# EAGLE schematic VCFA_v2 (EAGLE 9.4.2)

## Sheet 1 of 4: Balance Input Block
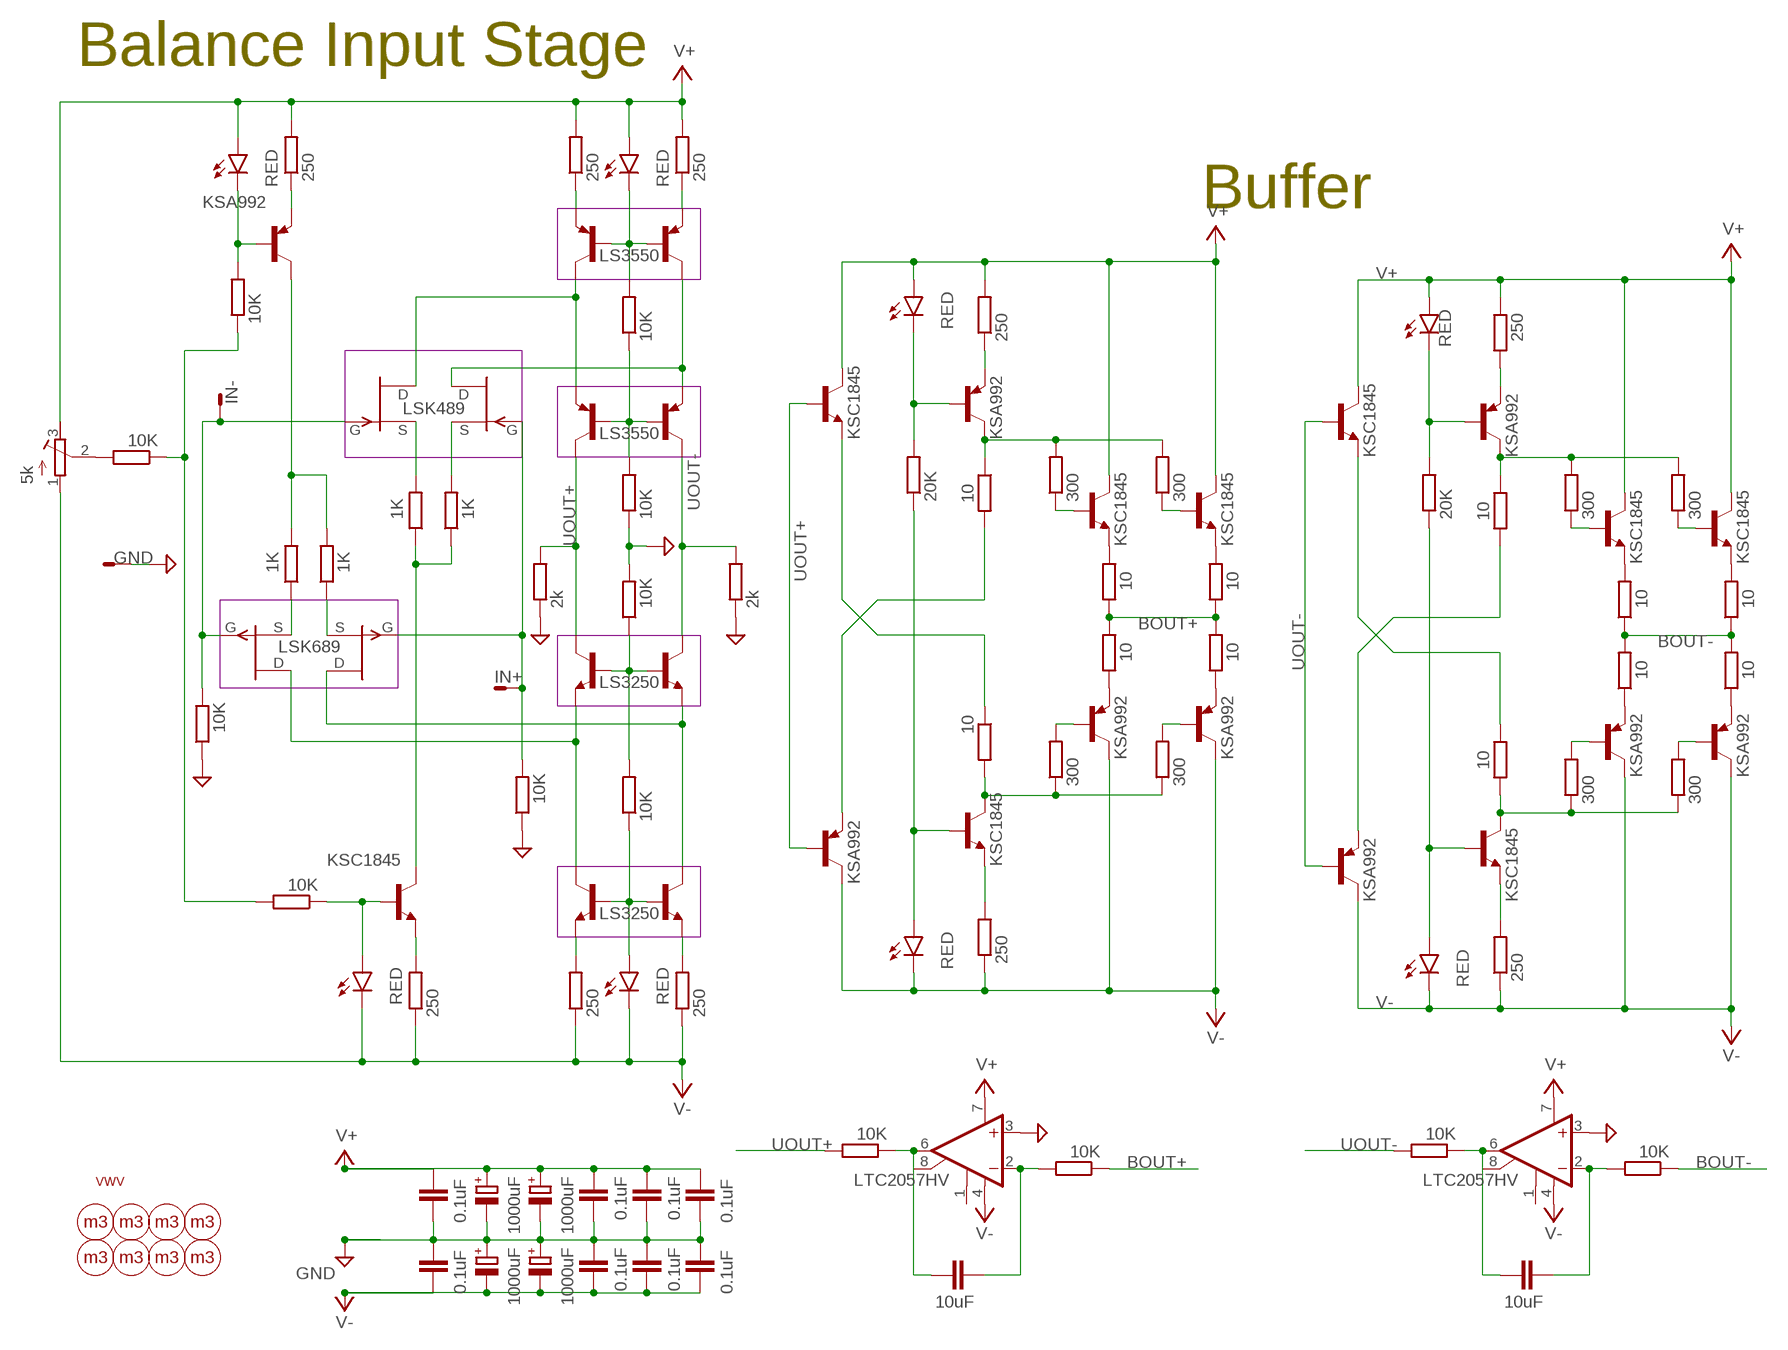
[diagram p0: schematic, sheet 1]

### Parts
C3  0.1uF  C-EUC0805  [C0805]
C4  0.1uF  C-EUC0805  [C0805]
C5  1000uF  CPOL-EUE7.5-18  [E7,5-18]
C6  1000uF  CPOL-EUE7.5-18  [E7,5-18]
C7  1000uF  CPOL-EUE7.5-18  [E7,5-18]
C8  1000uF  CPOL-EUE7.5-18  [E7,5-18]
C9  0.1uF  C-EU050-045X075  [C050-045X075]
C10  0.1uF  C-EU050-045X075  [C050-045X075]
C11  0.1uF  C-EU050-045X075  [C050-045X075]
C12  0.1uF  C-EU050-045X075  [C050-045X075]
C13  10uF  C-EUC1206  [C1206]
C14  0.1uF  C-EUC0805  [C0805]
C15  0.1uF  C-EUC0805  [C0805]
C16  10uF  C-EUC1206  [C1206]
H1  HOLE  [M3_HOLE]
H2  HOLE  [M3_HOLE]
H3  HOLE  [M3_HOLE]
H4  HOLE  [M3_HOLE]
H5  HOLE  [M3_HOLE]
H6  HOLE  [M3_HOLE]
H7  HOLE  [M3_HOLE]
H8  HOLE  [M3_HOLE]
IC1  LTC2057HV  LT1007CS8  [SOIC8]
IC2  LTC2057HV  LT1007CS8  [SOIC8]
LED1  RED  LEDVWV1206  [LED_SML1206]
LED2  RED  LEDVWV1206  [LED_SML1206]
LED3  RED  LEDVWV1206  [LED_SML1206]
LED4  RED  LEDVWV1206  [LED_SML1206]
LED5  RED  LEDVWV1206  [LED_SML1206]
LED6  RED  LEDVWV1206  [LED_SML1206]
LED7  RED  LEDVWV1206  [LED_SML1206]
LED8  RED  LEDVWV1206  [LED_SML1206]
Q1  LSK689  [SOT-23-6]
Q2  KSA992  BJT_PNPKSA992  [TRANSISTOR_TO92-ECB_P]
Q3  KSC1845  BJT_NPNKSC1845  [TRANSISTOR_TO92-ECB_N]
Q4  LSK489  LSK489SOP-6  [SOT-23-6]
Q5  LS3550  [SOT-23-6]
Q6  LS3250  [SOT-23-6]
Q7  LS3250  [SOT-23-6]
Q8  LS3550  [SOT-23-6]
Q9  KSC1845  BJT_NPNKSC1845  [TRANSISTOR_TO92-ECB_N]
Q10  KSA992  BJT_PNPKSA992  [TRANSISTOR_TO92-ECB_P]
Q11  KSA992  BJT_PNPKSA992  [TRANSISTOR_TO92-ECB_P]
Q12  KSC1845  BJT_NPNKSC1845  [TRANSISTOR_TO92-ECB_N]
Q13  KSC1845  BJT_NPNKSC1845  [TRANSISTOR_TO92-ECB_N]
Q14  KSA992  BJT_PNPKSA992  [TRANSISTOR_TO92-ECB_P]
Q15  KSC1845  BJT_NPNKSC1845  [TRANSISTOR_TO92-ECB_N]
Q16  KSA992  BJT_PNPKSA992  [TRANSISTOR_TO92-ECB_P]
Q17  KSC1845  BJT_NPNKSC1845  [TRANSISTOR_TO92-ECB_N]
Q18  KSA992  BJT_PNPKSA992  [TRANSISTOR_TO92-ECB_P]
Q19  KSA992  BJT_PNPKSA992  [TRANSISTOR_TO92-ECB_P]
Q20  KSC1845  BJT_NPNKSC1845  [TRANSISTOR_TO92-ECB_N]
Q21  KSC1845  BJT_NPNKSC1845  [TRANSISTOR_TO92-ECB_N]
Q22  KSA992  BJT_PNPKSA992  [TRANSISTOR_TO92-ECB_P]
Q23  KSC1845  BJT_NPNKSC1845  [TRANSISTOR_TO92-ECB_N]
Q24  KSA992  BJT_PNPKSA992  [TRANSISTOR_TO92-ECB_P]
R1  5k  R-TRIMM3296W  [RTRIM3296W]
R2  10K  R-EU_MELF0204W  [MINI_MELF-0204W]
R3  10K  R-EU_MELF0204W  [MINI_MELF-0204W]
R4  10K  R-EU_MELF0204W  [MINI_MELF-0204W]
R5  250  R-EU_MELF0204W  [MINI_MELF-0204W]
R6  1K  R-EU_MELF0204W  [MINI_MELF-0204W]
R7  250  R-EU_MELF0204W  [MINI_MELF-0204W]
R8  1K  R-EU_MELF0204W  [MINI_MELF-0204W]
R9  1K  R-EU_MELF0204W  [MINI_MELF-0204W]
R10  1K  R-EU_MELF0204W  [MINI_MELF-0204W]
R11  2k  R-EU_MELF0204W  [MINI_MELF-0204W]
R12  250  R-EU_MELF0204W  [MINI_MELF-0204W]
R13  250  R-EU_MELF0204W  [MINI_MELF-0204W]
R14  10K  R-EU_MELF0204W  [MINI_MELF-0204W]
R15  10K  R-EU_MELF0204W  [MINI_MELF-0204W]
R16  10K  R-EU_MELF0204W  [MINI_MELF-0204W]
R17  10K  R-EU_MELF0204W  [MINI_MELF-0204W]
R18  250  R-EU_MELF0204W  [MINI_MELF-0204W]
R19  250  R-EU_MELF0204W  [MINI_MELF-0204W]
R20  2k  R-EU_MELF0204W  [MINI_MELF-0204W]
R21  10K  R-EU_MELF0204W  [MINI_MELF-0204W]
R22  20K  R-EU_MELF0204W  [MINI_MELF-0204W]
R23  250  R-EU_MELF0204W  [MINI_MELF-0204W]
R24  10  R-EU_MELF0204W  [MINI_MELF-0204W]
R25  10  R-EU_MELF0204W  [MINI_MELF-0204W]
R26  250  R-EU_MELF0204W  [MINI_MELF-0204W]
R27  300  R-EU_MELF0204W  [MINI_MELF-0204W]
R28  300  R-EU_MELF0204W  [MINI_MELF-0204W]
R29  10K  R-EU_MELF0204W  [MINI_MELF-0204W]
R30  10  R-EU_MELF0204W  [MINI_MELF-0204W]
R31  10  R-EU_MELF0204W  [MINI_MELF-0204W]
R32  300  R-EU_MELF0204W  [MINI_MELF-0204W]
R33  300  R-EU_MELF0204W  [MINI_MELF-0204W]
R34  10  R-EU_MELF0204W  [MINI_MELF-0204W]
R35  10  R-EU_MELF0204W  [MINI_MELF-0204W]
R36  10K  R-EU_MELF0204W  [MINI_MELF-0204W]
R37  20K  R-EU_MELF0204W  [MINI_MELF-0204W]
R38  250  R-EU_MELF0204W  [MINI_MELF-0204W]
R39  10  R-EU_MELF0204W  [MINI_MELF-0204W]
R40  10  R-EU_MELF0204W  [MINI_MELF-0204W]
R41  250  R-EU_MELF0204W  [MINI_MELF-0204W]
R42  300  R-EU_MELF0204W  [MINI_MELF-0204W]
R43  300  R-EU_MELF0204W  [MINI_MELF-0204W]
R44  10K  R-EU_MELF0204W  [MINI_MELF-0204W]
R45  10  R-EU_MELF0204W  [MINI_MELF-0204W]
R46  10  R-EU_MELF0204W  [MINI_MELF-0204W]
R47  300  R-EU_MELF0204W  [MINI_MELF-0204W]
R48  300  R-EU_MELF0204W  [MINI_MELF-0204W]
R49  10  R-EU_MELF0204W  [MINI_MELF-0204W]
R50  10  R-EU_MELF0204W  [MINI_MELF-0204W]
R134  10K  R-EU_MELF0204W  [MINI_MELF-0204W]
R135  10K  R-EU_MELF0204W  [MINI_MELF-0204W]
S1  VWV  [VWV]
X1  KK-156-3  [KK-156-3]

### Nets
BOUT+: R29.1 R30.1 R31.2 R34.1 R35.2 ; also sheet 2
BOUT-: R44.1 R45.1 R46.2 R49.1 R50.2 ; also sheet 2
GND: C3.1 C4.2 C5.- C6.+ C7.- C8.+ C9.2 C10.1 C11.2 C12.1 C14.1 C15.2 IC1.3(+IN) IC2.3(+IN) R11.1 R15.1 R16.2 R20.1 R134.1 R135.1 X1.2 ; also sheet 2,3,4
IN+: Q1.4(G) Q4.4(G) R134.2 X1.3
IN-: Q1.1(G) Q4.1(G) R135.2 X1.1
N$2: Q8.2(E) R12.1
N$4: Q10.E R24.2
N$5: Q12.E R26.2
N$6: Q11.E R23.1
N$7: LED5.C Q11.B R22.2
N$8: LED6.A Q12.B R22.1
N$9: Q11.C R24.1 R27.2 R32.2
N$10: Q12.C R25.2 R28.1 R33.1
N$11: Q9.E R25.1
N$13: Q13.B R27.1
N$14: Q13.E R30.2
N$15: Q16.B R33.2
N$16: Q15.B R32.1
N$17: Q14.B R28.2
N$18: Q14.E R31.1
N$19: C13.2 IC1.2(-IN) R29.2
N$20: Q15.E R34.2
N$21: Q16.E R35.1
N$22: C13.1 IC1.6(OUT) R21.1
N$23: Q8.5(E) R18.1
N$24: R2.1 R3.1 R4.2
N$43: Q20.E R41.2
N$44: Q19.E R38.1
N$45: LED7.C Q19.B R37.2
N$46: LED8.A Q20.B R37.1
N$47: Q19.C R39.1 R42.2 R47.2
N$48: Q20.C R40.2 R43.1 R48.1
N$49: Q18.E R39.2
N$50: Q17.E R40.1
N$52: Q21.B R42.1
N$53: Q22.B R43.2
N$54: Q23.B R47.1
N$55: Q24.B R48.2
N$56: Q21.E R45.2
N$57: Q22.E R46.1
N$58: Q23.E R49.2
N$59: Q24.E R50.1
N$60: C16.2 IC2.2(-IN) R44.2
N$61: C16.1 IC2.6(OUT) R36.1
N$92: R1.2(S) R2.2
N$93: Q7.5(E) R13.2
N$94: Q7.2(E) R19.2
N$95: Q1.5(D) Q6.2(E) Q7.4(C)
N$96: Q1.2(D) Q6.5(E) Q7.6(C)
N$97: LED4.A Q7.1(B) Q7.3(B) R17.1
N$98: Q6.1(B) Q6.3(B) R16.1 R17.2
N$99: LED2.A Q3.B R4.1
N$101: Q5.1(B) Q5.3(B) R14.1 R15.2
N$102: Q4.2(D) Q5.5(E) Q8.4(C)
N$103: LED3.C Q8.1(B) Q8.3(B) R14.2
N$104: Q4.5(D) Q5.2(E) Q8.6(C)
N$108: LED1.C Q2.B R3.2
N$109: Q2.E R5.1
N$110: Q2.C R6.2 R8.2
N$111: Q1.6(S) R8.1
N$112: Q1.3(S) R6.1
N$115: Q4.3(S) R9.2
N$116: Q4.6(S) R10.2
N$117: Q3.C R9.1 R10.1
N$118: Q3.E R7.2
UOUT+: Q5.6(C) Q6.6(C) Q9.B Q10.B R11.2 R21.2
UOUT-: Q5.4(C) Q6.4(C) Q17.B Q18.B R20.2 R36.2
V+: C3.2 C5.+ C7.+ C9.1 C11.1 C14.2 IC1.7(V+) IC2.7(V+) LED1.A LED3.A LED5.A LED7.A Q9.C Q13.C Q15.C Q17.C Q21.C Q23.C R1.3(E) R5.2 R12.2 R18.2 R23.2 R38.2 ; also sheet 2,3
V-: C4.1 C6.- C8.- C10.2 C12.2 C15.1 IC1.4(V-) IC2.4(V-) LED2.C LED4.C LED6.C LED8.C Q10.C Q14.C Q16.C Q18.C Q22.C Q24.C R1.1(A) R7.1 R13.1 R19.1 R26.1 R41.1 ; also sheet 2,3
Unconnected: IC1.1(CMP1) IC1.8(CMP2) IC2.1(CMP1) IC2.8(CMP2)

### Notes on the sheet
- Balance Input Stage
- Buffer

## Sheet 2 of 4: CFA Block
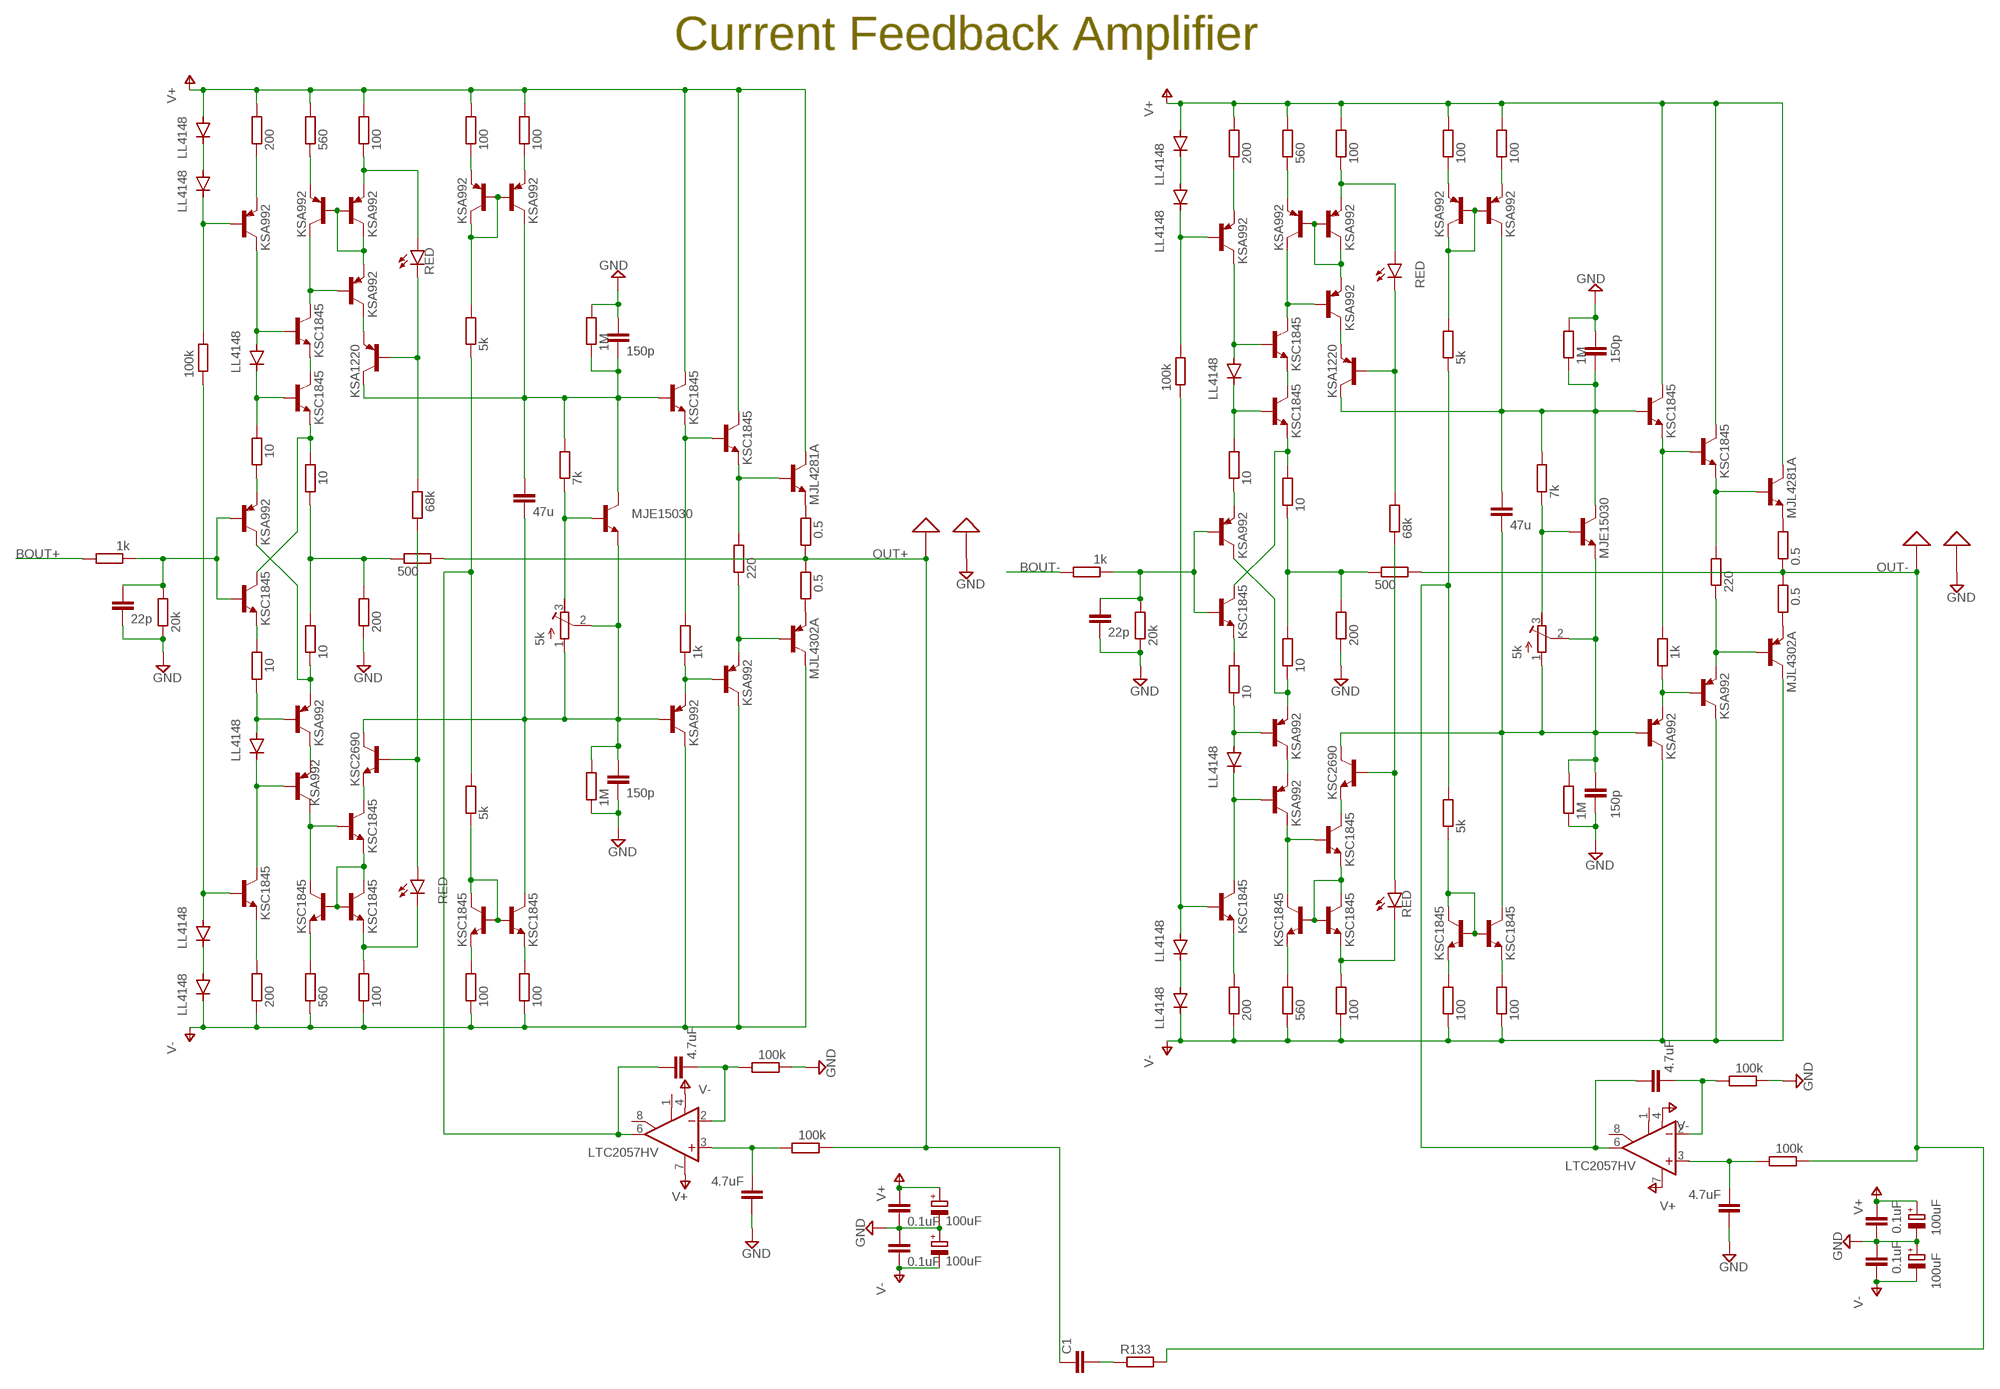
[diagram p1: schematic, sheet 2]

### Parts
C1  C-EUECWU-V  [ECHU-Y]
C17  22p  C-EUC0805  [C0805]
C18  47u  C-EUC1210  [C1210]
C19  150p  C-EUC0805  [C0805]
C20  150p  C-EUC0805  [C0805]
C21  4.7uF  C-EUC1210  [C1210]
C22  4.7uF  C-EUC1210  [C1210]
C23  0.1uF  C-EUC0603K  [C0603K]
C24  0.1uF  C-EUC0603K  [C0603K]
C25  100uF  CPOL-EUE3.5-8  [E3,5-8]
C26  100uF  CPOL-EUE3.5-8  [E3,5-8]
C27  22p  C-EUC0805  [C0805]
C28  47u  C-EUC1210  [C1210]
C29  150p  C-EUC0805  [C0805]
C30  150p  C-EUC0805  [C0805]
C31  4.7uF  C-EUC1210  [C1210]
C32  4.7uF  C-EUC1210  [C1210]
C33  0.1uF  C-EUC0603K  [C0603K]
C34  0.1uF  C-EUC0603K  [C0603K]
C35  100uF  CPOL-EUE3.5-8  [E3,5-8]
C36  100uF  CPOL-EUE3.5-8  [E3,5-8]
D1  LL4148  DIODE-SOD80C  [SOD80C]
D2  LL4148  DIODE-SOD80C  [SOD80C]
D3  LL4148  DIODE-SOD80C  [SOD80C]
D4  LL4148  DIODE-SOD80C  [SOD80C]
D5  LL4148  DIODE-SOD80C  [SOD80C]
D6  LL4148  DIODE-SOD80C  [SOD80C]
D7  LL4148  DIODE-SOD80C  [SOD80C]
D8  LL4148  DIODE-SOD80C  [SOD80C]
D9  LL4148  DIODE-SOD80C  [SOD80C]
D10  LL4148  DIODE-SOD80C  [SOD80C]
D11  LL4148  DIODE-SOD80C  [SOD80C]
D12  LL4148  DIODE-SOD80C  [SOD80C]
IC3  LTC2057HV  LT1037IS8  [SOIC8]
IC4  LTC2057HV  LT1037IS8  [SOIC8]
LED9  RED  LEDVWV1206  [LED_SML1206]
LED10  RED  LEDVWV1206  [LED_SML1206]
LED11  RED  LEDVWV1206  [LED_SML1206]
LED12  RED  LEDVWV1206  [LED_SML1206]
PAD1  PAD  [PAD-16]
PAD2  PAD  [PAD-16]
PAD3  PAD  [PAD-16]
PAD4  PAD  [PAD-16]
Q25  KSA992  BJT_PNPKSA992  [TRANSISTOR_TO92-ECB_P]
Q26  KSA992  BJT_PNPKSA992  [TRANSISTOR_TO92-ECB_P]
Q27  KSC1845  BJT_NPNKSC1845  [TRANSISTOR_TO92-ECB_N]
Q28  KSC1845  BJT_NPNKSC1845  [TRANSISTOR_TO92-ECB_N]
Q29  KSC1845  BJT_NPNKSC1845  [TRANSISTOR_TO92-ECB_N]
Q30  KSC1845  BJT_NPNKSC1845  [TRANSISTOR_TO92-ECB_N]
Q31  KSA992  BJT_PNPKSA992  [TRANSISTOR_TO92-ECB_P]
Q32  KSA992  BJT_PNPKSA992  [TRANSISTOR_TO92-ECB_P]
Q33  KSA992  BJT_PNPKSA992  [TRANSISTOR_TO92-ECB_P]
Q34  KSC1845  BJT_NPNKSC1845  [TRANSISTOR_TO92-ECB_N]
Q35  KSA992  BJT_PNPKSA992  [TRANSISTOR_TO92-ECB_P]
Q36  KSA992  BJT_PNPKSA992  [TRANSISTOR_TO92-ECB_P]
Q37  KSC1845  BJT_NPNKSC1845  [TRANSISTOR_TO92-ECB_N]
Q38  KSC1845  BJT_NPNKSC1845  [TRANSISTOR_TO92-ECB_N]
Q39  KSA1220  BJT_PNPKSA1220  [TRANSISTOR_TO126_P]
Q40  KSC2690  BJT_NPNKSC2690  [TRANSISTOR_TO126_N]
Q41  KSA992  BJT_PNPKSA992  [TRANSISTOR_TO92-ECB_P]
Q42  KSC1845  BJT_NPNKSC1845  [TRANSISTOR_TO92-ECB_N]
Q43  KSA992  BJT_PNPKSA992  [TRANSISTOR_TO92-ECB_P]
Q44  KSC1845  BJT_NPNKSC1845  [TRANSISTOR_TO92-ECB_N]
Q45  MJE15030  BJT_NPNMJE15030  [TRANSISTOR_TO220_BCE_N]
Q46  KSC1845  BJT_NPNKSC1845  [TRANSISTOR_TO92-ECB_N]
Q47  KSA992  BJT_PNPKSA992  [TRANSISTOR_TO92-ECB_P]
Q48  KSC1845  BJT_NPNKSC1845  [TRANSISTOR_TO92-ECB_N]
Q49  KSA992  BJT_PNPKSA992  [TRANSISTOR_TO92-ECB_P]
Q50  MJL4281A  BJT_NPNMJL4281  [TRANSISTOR_TO247_BCE_N]
Q51  MJL4302A  BJT_PNPMJL4302  [TRANSISTOR_TO247_BCE_P]
Q52  KSA992  BJT_PNPKSA992  [TRANSISTOR_TO92-ECB_P]
Q53  KSA992  BJT_PNPKSA992  [TRANSISTOR_TO92-ECB_P]
Q54  KSC1845  BJT_NPNKSC1845  [TRANSISTOR_TO92-ECB_N]
Q55  KSC1845  BJT_NPNKSC1845  [TRANSISTOR_TO92-ECB_N]
Q56  KSC1845  BJT_NPNKSC1845  [TRANSISTOR_TO92-ECB_N]
Q57  KSC1845  BJT_NPNKSC1845  [TRANSISTOR_TO92-ECB_N]
Q58  KSA992  BJT_PNPKSA992  [TRANSISTOR_TO92-ECB_P]
Q59  KSA992  BJT_PNPKSA992  [TRANSISTOR_TO92-ECB_P]
Q60  KSA992  BJT_PNPKSA992  [TRANSISTOR_TO92-ECB_P]
Q61  KSC1845  BJT_NPNKSC1845  [TRANSISTOR_TO92-ECB_N]
Q62  KSA992  BJT_PNPKSA992  [TRANSISTOR_TO92-ECB_P]
Q63  KSA992  BJT_PNPKSA992  [TRANSISTOR_TO92-ECB_P]
Q64  KSC1845  BJT_NPNKSC1845  [TRANSISTOR_TO92-ECB_N]
Q65  KSC1845  BJT_NPNKSC1845  [TRANSISTOR_TO92-ECB_N]
Q66  KSA1220  BJT_PNPKSA1220  [TRANSISTOR_TO126_P]
Q67  KSC2690  BJT_NPNKSC2690  [TRANSISTOR_TO126_N]
Q68  KSA992  BJT_PNPKSA992  [TRANSISTOR_TO92-ECB_P]
Q69  KSC1845  BJT_NPNKSC1845  [TRANSISTOR_TO92-ECB_N]
Q70  KSA992  BJT_PNPKSA992  [TRANSISTOR_TO92-ECB_P]
Q71  KSC1845  BJT_NPNKSC1845  [TRANSISTOR_TO92-ECB_N]
Q72  MJE15030  BJT_NPNMJE15030  [TRANSISTOR_TO220_BCE_N]
Q73  KSC1845  BJT_NPNKSC1845  [TRANSISTOR_TO92-ECB_N]
Q74  KSA992  BJT_PNPKSA992  [TRANSISTOR_TO92-ECB_P]
Q75  KSC1845  BJT_NPNKSC1845  [TRANSISTOR_TO92-ECB_N]
Q76  KSA992  BJT_PNPKSA992  [TRANSISTOR_TO92-ECB_P]
Q77  MJL4281A  BJT_NPNMJL4281  [TRANSISTOR_TO247_BCE_N]
Q78  MJL4302A  BJT_PNPMJL4302  [TRANSISTOR_TO247_BCE_P]
R51  1k  R-EU_MELF0204W  [MINI_MELF-0204W]
R52  20k  R-EU_MELF0204W  [MINI_MELF-0204W]
R53  100k  R-EU_MELF0204W  [MINI_MELF-0204W]
R54  200  R-EU_MELF0204W  [MINI_MELF-0204W]
R55  10  R-EU_MELF0204W  [MINI_MELF-0204W]
R56  10  R-EU_MELF0204W  [MINI_MELF-0204W]
R57  200  R-EU_MELF0204W  [MINI_MELF-0204W]
R58  560  R-EU_MELF0204W  [MINI_MELF-0204W]
R59  10  R-EU_MELF0204W  [MINI_MELF-0204W]
R60  10  R-EU_MELF0204W  [MINI_MELF-0204W]
R61  560  R-EU_MELF0204W  [MINI_MELF-0204W]
R62  100  R-EU_MELF0204W  [MINI_MELF-0204W]
R63  200  R-EU_MELF0204W  [MINI_MELF-0204W]
R64  100  R-EU_MELF0204W  [MINI_MELF-0204W]
R65  68k  R-EU_MELF0204W  [MINI_MELF-0204W]
R66  500  R-EU_MELF0204W  [MINI_MELF-0204W]
R67  100  R-EU_MELF0204W  [MINI_MELF-0204W]
R68  5k  R-EU_MELF0204W  [MINI_MELF-0204W]
R69  5k  R-EU_MELF0204W  [MINI_MELF-0204W]
R70  100  R-EU_MELF0204W  [MINI_MELF-0204W]
R71  100  R-EU_MELF0204W  [MINI_MELF-0204W]
R72  100  R-EU_MELF0204W  [MINI_MELF-0204W]
R73  7k  R-EU_MELF0204W  [MINI_MELF-0204W]
R74  5k  R-TRIMM3296W  [RTRIM3296W]
R75  1M  R-EU_MELF0204W  [MINI_MELF-0204W]
R76  1M  R-EU_MELF0204W  [MINI_MELF-0204W]
R77  1k  R-EU_MELF0204W  [MINI_MELF-0204W]
R78  220  R-EU_MELF0204W  [MINI_MELF-0204W]
R79  100k  R-EU_MELF0204W  [MINI_MELF-0204W]
R80  0.5  R-EU_R2512  [R2512]
R81  0.5  R-EU_R2512  [R2512]
R82  100k  R-EU_MELF0204W  [MINI_MELF-0204W]
R83  1k  R-EU_MELF0204W  [MINI_MELF-0204W]
R84  20k  R-EU_MELF0204W  [MINI_MELF-0204W]
R85  100k  R-EU_MELF0204W  [MINI_MELF-0204W]
R86  200  R-EU_MELF0204W  [MINI_MELF-0204W]
R87  10  R-EU_MELF0204W  [MINI_MELF-0204W]
R88  10  R-EU_MELF0204W  [MINI_MELF-0204W]
R89  200  R-EU_MELF0204W  [MINI_MELF-0204W]
R90  560  R-EU_MELF0204W  [MINI_MELF-0204W]
R91  10  R-EU_MELF0204W  [MINI_MELF-0204W]
R92  10  R-EU_MELF0204W  [MINI_MELF-0204W]
R93  560  R-EU_MELF0204W  [MINI_MELF-0204W]
R94  100  R-EU_MELF0204W  [MINI_MELF-0204W]
R95  200  R-EU_MELF0204W  [MINI_MELF-0204W]
R96  100  R-EU_MELF0204W  [MINI_MELF-0204W]
R97  68k  R-EU_MELF0204W  [MINI_MELF-0204W]
R98  500  R-EU_MELF0204W  [MINI_MELF-0204W]
R99  100  R-EU_MELF0204W  [MINI_MELF-0204W]
R100  5k  R-EU_MELF0204W  [MINI_MELF-0204W]
R101  5k  R-EU_MELF0204W  [MINI_MELF-0204W]
R102  100  R-EU_MELF0204W  [MINI_MELF-0204W]
R103  100  R-EU_MELF0204W  [MINI_MELF-0204W]
R104  100  R-EU_MELF0204W  [MINI_MELF-0204W]
R105  7k  R-EU_MELF0204W  [MINI_MELF-0204W]
R106  5k  R-TRIMM3296W  [RTRIM3296W]
R107  1M  R-EU_MELF0204W  [MINI_MELF-0204W]
R108  1M  R-EU_MELF0204W  [MINI_MELF-0204W]
R109  1k  R-EU_MELF0204W  [MINI_MELF-0204W]
R110  220  R-EU_MELF0204W  [MINI_MELF-0204W]
R111  100k  R-EU_MELF0204W  [MINI_MELF-0204W]
R112  0.5  R-EU_R2512  [R2512]
R113  0.5  R-EU_R2512  [R2512]
R114  100k  R-EU_MELF0204W  [MINI_MELF-0204W]
R133  R-EU_R2512  [R2512]

### Nets
BOUT+: R51.2 ; also sheet 1
BOUT-: R83.2 ; also sheet 1
GND: C17.2 C19.1 C20.2 C22.1 C23.2 C24.1 C25.- C26.+ C27.2 C29.1 C30.2 C32.1 C33.2 C34.1 C35.- C36.+ PAD3.P$1 PAD4.P$1 R52.1 R63.1 R75.2 R76.1 R79.1 R84.1 R95.1 R107.2 R108.1 R111.1 ; also sheet 1,3,4
N$3: Q25.E R54.1
N$12: D5.A Q25.C Q29.B
N$25: D1.C D2.A
N$26: D2.C Q25.B R53.2
N$27: D5.C Q30.B R55.2
N$28: Q29.E Q30.C
N$29: Q27.C Q30.E R59.2
N$30: R59.1 R60.2 R63.2 R66.1
N$31: Q26.C Q31.E R60.1
N$32: D6.A Q31.B R56.1
N$33: D6.C Q28.C Q32.B
N$34: Q28.E R57.2
N$35: D3.C D4.A
N$36: Q31.C Q32.E
N$37: Q26.E R55.1
N$38: Q27.E R56.2
N$39: C17.1 Q26.B Q27.B R51.1 R52.2
N$40: Q29.C Q33.C Q36.B
N$41: Q33.B Q35.B Q35.C Q36.E
N$42: Q33.E R58.1
N$51: LED9.A Q35.E R62.1
N$62: Q36.C Q39.E
N$63: LED9.C Q39.B R65.2
N$64: Q34.B Q37.E Q38.B Q38.C
N$65: LED10.C Q38.E R64.2
N$66: Q34.E R61.2
N$67: Q32.C Q34.C Q37.B
N$68: Q37.C Q40.E
N$69: LED10.A Q40.B R65.1
N$70: C18.1 C19.2 Q39.C Q43.C Q45.C Q46.B R73.2 R75.1
N$71: Q41.B Q41.C Q43.B R68.2
N$72: Q42.B Q42.C Q44.B R69.1
N$73: Q41.E R67.1
N$74: Q43.E R71.1
N$76: Q42.E R70.2
N$77: Q44.E R72.2
N$78: Q46.E Q48.B R77.2
N$79: Q47.E Q49.B R77.1
N$80: C18.2 C20.1 Q40.C Q44.C Q45.E Q47.B R74.1(A) R74.2(S) R76.2
N$81: Q48.E Q50.B R78.2
N$82: Q49.E Q51.B R78.1
N$83: Q50.E R80.2
N$84: Q51.E R81.1
N$85: C21.2 IC3.2(-IN) R79.2
N$86: C22.2 IC3.3(+IN) R82.2
N$87: D3.A Q28.B R53.1
N$88: Q45.B R73.1 R74.3(E)
N$89: C21.1 IC3.6(OUT) R68.1 R69.2
N$140: C1.2 R133.1
N$159: Q52.E R86.1
N$160: D11.A Q52.C Q56.B
N$161: D7.C D8.A
N$162: D8.C Q52.B R85.2
N$163: D11.C Q57.B R87.2
N$164: Q56.E Q57.C
N$165: Q54.C Q57.E R91.2
N$166: R91.1 R92.2 R95.2 R98.1
N$167: Q53.C Q58.E R92.1
N$168: D12.A Q58.B R88.1
N$169: D12.C Q55.C Q59.B
N$170: Q55.E R89.2
N$171: D9.C D10.A
N$172: Q58.C Q59.E
N$173: Q53.E R87.1
N$174: Q54.E R88.2
N$175: C27.1 Q53.B Q54.B R83.1 R84.2
N$176: Q56.C Q60.C Q63.B
N$177: Q60.B Q62.B Q62.C Q63.E
N$178: Q60.E R90.1
N$179: LED11.A Q62.E R94.1
N$180: Q63.C Q66.E
N$181: LED11.C Q66.B R97.2
N$182: Q61.B Q64.E Q65.B Q65.C
N$231: LED12.C Q65.E R96.2
N$232: Q61.E R93.2
N$233: Q59.C Q61.C Q64.B
N$234: Q64.C Q67.E
N$235: LED12.A Q67.B R97.1
N$236: C28.1 C29.2 Q66.C Q70.C Q72.C Q73.B R105.2 R107.1
N$237: Q68.B Q68.C Q70.B R100.2
N$238: Q69.B Q69.C Q71.B R101.1
N$239: Q68.E R99.1
N$240: Q70.E R103.1
N$242: Q69.E R102.2
N$243: Q71.E R104.2
N$244: Q73.E Q75.B R109.2
N$245: Q74.E Q76.B R109.1
N$246: C28.2 C30.1 Q67.C Q71.C Q72.E Q74.B R106.1(A) R106.2(S) R108.2
N$247: Q75.E Q77.B R110.2
N$248: Q76.E Q78.B R110.1
N$249: Q77.E R112.2
N$250: Q78.E R113.1
N$251: C31.2 IC4.2(-IN) R111.2
N$252: C32.2 IC4.3(+IN) R114.2
N$253: D9.A Q55.B R85.1
N$254: Q72.B R105.1 R106.3(E)
N$255: C31.1 IC4.6(OUT) R100.1 R101.2
OUT+: C1.1 PAD1.P$1 R66.2 R80.1 R81.2 R82.1
OUT-: PAD2.P$1 R98.2 R112.1 R113.2 R114.1 R133.2
V+: C23.1 C25.+ C33.1 C35.+ D1.A D7.A IC3.7(V+) IC4.7(V+) Q46.C Q48.C Q50.C Q73.C Q75.C Q77.C R54.2 R58.2 R62.2 R67.2 R71.2 R86.2 R90.2 R94.2 R99.2 R103.2 ; also sheet 1,3
V-: C24.2 C26.- C34.2 C36.- D4.C D10.C IC3.4(V-) IC4.4(V-) Q47.C Q49.C Q51.C Q74.C Q76.C Q78.C R57.1 R61.1 R64.1 R70.1 R72.1 R89.1 R93.1 R96.1 R102.1 R104.1 ; also sheet 1,3
Unconnected: IC3.1(CMP1) IC3.8(CMP2) IC4.1(CMP1) IC4.8(CMP2)

### Notes on the sheet
- Current Feedback Amplifier

## Sheet 3 of 4: Power Supply
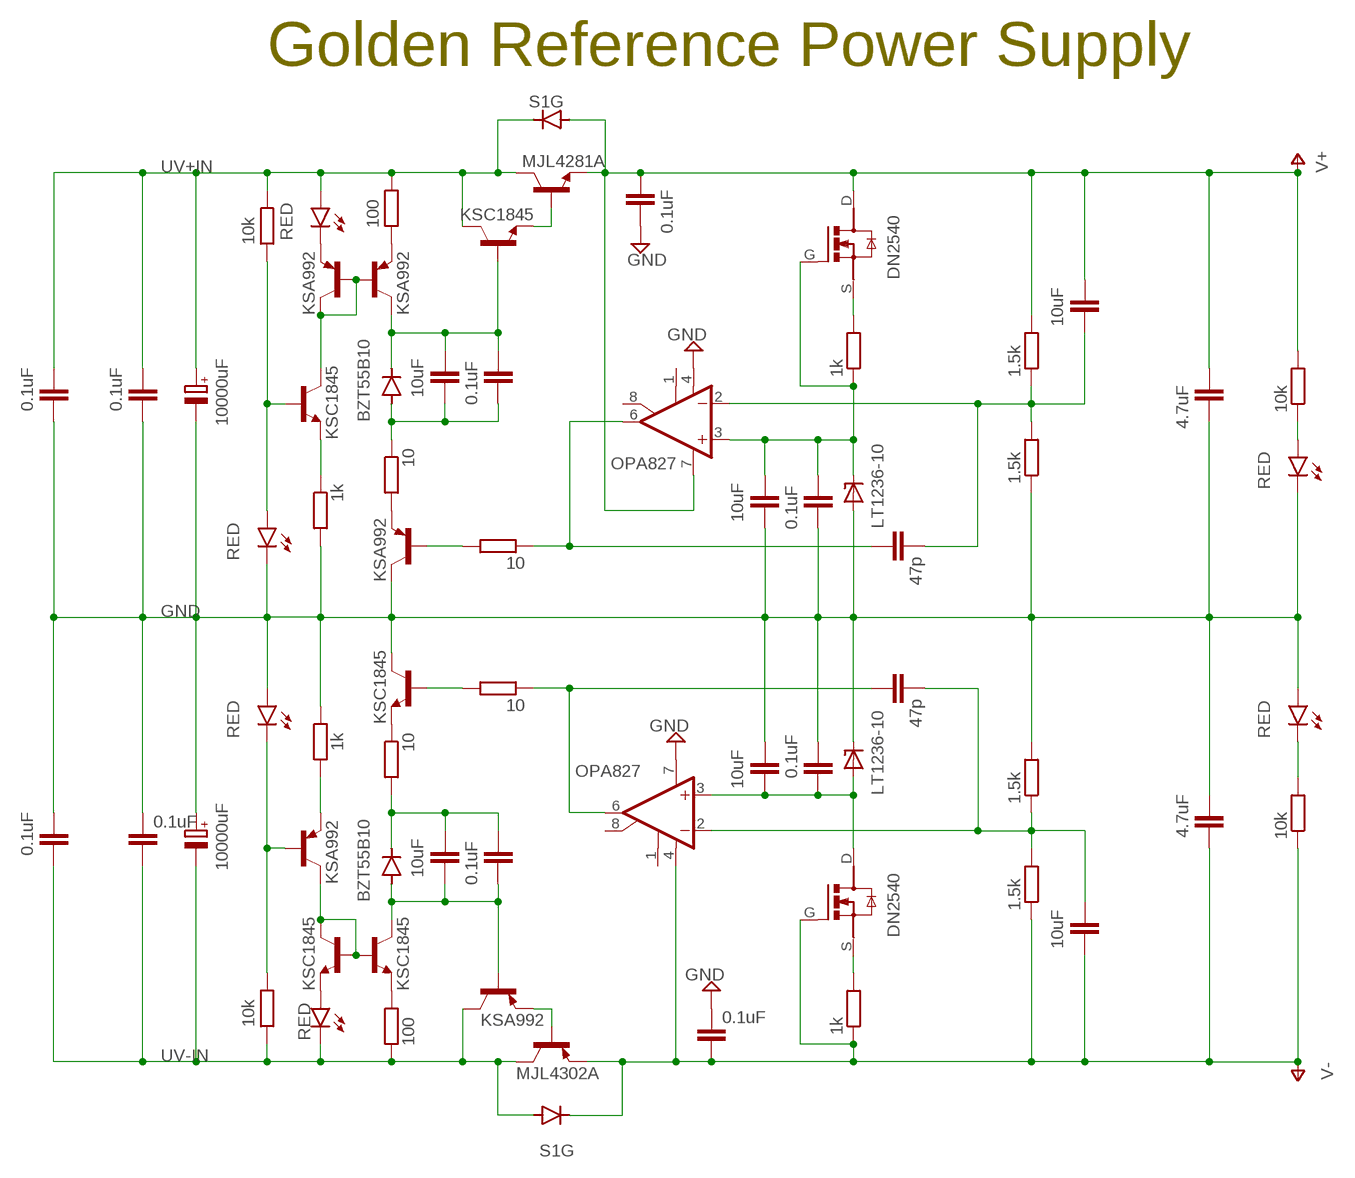
[diagram p2: schematic, sheet 3]

### Parts
C37  10000uF  CPOL-EU  [EB35D-8.5]
C38  10000uF  CPOL-EU  [EB35D-8.5]
C39  0.1uF  C-EU050-045X075  [C050-045X075]
C40  10uF  C-EUC1206  [C1206]
C41  10uF  C-EUC1206  [C1206]
C42  0.1uF  C-EU050-045X075  [C050-045X075]
C43  0.1uF  C-EUC0805  [C0805]
C44  0.1uF  C-EUC0805  [C0805]
C45  0.1uF  C-EUC0805  [C0805]
C46  0.1uF  C-EUC0805  [C0805]
C47  10uF  C-EUC1206  [C1206]
C48  10uF  C-EUC1206  [C1206]
C49  0.1uF  C-EUC0805  [C0805]
C50  0.1uF  C-EUC0805  [C0805]
C51  47p  C-EUC0805  [C0805]
C52  47p  C-EUC0805  [C0805]
C53  10uF  C-EUC1206  [C1206]
C54  10uF  C-EUC1206  [C1206]
C55  4.7uF  C-EU050-075X075  [C050-075X075]
C56  4.7uF  C-EU050-075X075  [C050-075X075]
C58  0.1uF  C-EU050-045X075  [C050-045X075]
C60  0.1uF  C-EU050-045X075  [C050-045X075]
D13  BZT55B10  DIODE-SOD80C  [SOD80C]
D14  BZT55B10  DIODE-SOD80C  [SOD80C]
D15  S1G  DIODE-DO214AA  [DO214AA]
D16  S1G  DIODE-DO214AA  [DO214AA]
D17  LT1236-10  LINEAR-TECHNOLOGY_LT1021-VSO-8  [SO8]
D18  LT1236-10  LINEAR-TECHNOLOGY_LT1021-VSO-8  [SO8]
IC5  OPA827  LT1037CS8  [SOIC8]
IC6  OPA827  LT1037CS8  [SOIC8]
LED13  RED  LEDVWV1206  [LED_SML1206]
LED14  RED  LEDVWV1206  [LED_SML1206]
LED15  RED  LEDVWV1206  [LED_SML1206]
LED16  RED  LEDVWV1206  [LED_SML1206]
LED17  RED  LEDVWV1206  [LED_SML1206]
LED18  RED  LEDVWV1206  [LED_SML1206]
Q79  KSC1845  BJT_NPNKSC1845  [TRANSISTOR_TO92-ECB_N]
Q80  KSA992  BJT_PNPKSA992  [TRANSISTOR_TO92-ECB_P]
Q81  KSA992  BJT_PNPKSA992  [TRANSISTOR_TO92-ECB_P]
Q82  KSC1845  BJT_NPNKSC1845  [TRANSISTOR_TO92-ECB_N]
Q83  KSA992  BJT_PNPKSA992  [TRANSISTOR_TO92-ECB_P]
Q84  KSC1845  BJT_NPNKSC1845  [TRANSISTOR_TO92-ECB_N]
Q85  KSA992  BJT_PNPKSA992  [TRANSISTOR_TO92-ECB_P]
Q86  KSC1845  BJT_NPNKSC1845  [TRANSISTOR_TO92-ECB_N]
Q87  KSC1845  BJT_NPNKSC1845  [TRANSISTOR_TO92-ECB_N]
Q88  KSA992  BJT_PNPKSA992  [TRANSISTOR_TO92-ECB_P]
Q89  MJL4281A  BJT_NPNMJL4281  [TRANSISTOR_TO247_BCE_N]
Q90  MJL4302A  BJT_PNPMJL4302  [TRANSISTOR_TO247_BCE_P]
Q91  DN2540  [TRANSISTOR_TO92-SGD_N]
Q92  DN2540  [TRANSISTOR_TO92-SGD_N]
R115  10k  R-EU_MELF0204W  [MINI_MELF-0204W]
R116  10k  R-EU_MELF0204W  [MINI_MELF-0204W]
R117  1k  R-EU_MELF0204W  [MINI_MELF-0204W]
R118  1k  R-EU_MELF0204W  [MINI_MELF-0204W]
R119  100  R-EU_MELF0204W  [MINI_MELF-0204W]
R120  10  R-EU_MELF0204W  [MINI_MELF-0204W]
R121  10  R-EU_MELF0204W  [MINI_MELF-0204W]
R122  100  R-EU_MELF0204W  [MINI_MELF-0204W]
R123  10  R-EU_MELF0204W  [MINI_MELF-0204W]
R124  10  R-EU_MELF0204W  [MINI_MELF-0204W]
R125  1k  R-EU_MELF0204W  [MINI_MELF-0204W]
R126  1k  R-EU_MELF0204W  [MINI_MELF-0204W]
R127  1.5k  R-EU_MELF0204W  [MINI_MELF-0204W]
R128  1.5k  R-EU_MELF0204W  [MINI_MELF-0204W]
R129  1.5k  R-EU_MELF0204W  [MINI_MELF-0204W]
R130  1.5k  R-EU_MELF0204W  [MINI_MELF-0204W]
R131  10k  R-EU_MELF0204W  [MINI_MELF-0204W]
R132  10k  R-EU_MELF0204W  [MINI_MELF-0204W]

### Nets
GND: C37.- C38.+ C39.2 C42.1 C45.1 C46.2 C47.2 C48.1 C49.2 C50.1 C55.1 C56.2 C58.1 C60.2 D17.4(GND) D18.6(OUT) IC5.7(V+) IC6.4(V-) LED13.C LED14.A LED17.C LED18.A Q85.C Q86.C R117.2 R118.1 R128.1 R129.2 ; also sheet 1,2,4
N$1: Q79.C Q81.B Q81.C Q83.B
N$75: LED15.C Q81.E
N$90: Q83.E R119.2
N$100: C40.1 C43.1 D13.C Q83.C Q87.B
N$105: C40.2 C43.2 D13.A R120.1
N$106: Q85.E R120.2
N$107: Q79.E R117.1
N$113: LED13.A Q79.B R115.2
N$114: Q80.E R118.2
N$119: LED14.C Q80.B R116.1
N$120: Q86.E R121.1
N$121: C41.1 C44.1 D14.C R121.2
N$122: C41.2 C44.2 D14.A Q84.C Q88.B
N$123: Q80.C Q82.B Q82.C Q84.B
N$124: Q84.E R122.1
N$125: LED16.A Q82.E
N$126: Q88.E Q90.B
N$127: Q87.E Q89.B
N$128: C51.1 IC6.6(OUT) R123.1
N$129: C52.1 IC5.6(OUT) R124.1
N$130: Q86.B R124.2
N$131: Q85.B R123.2
N$132: C51.2 C53.2 IC6.2(-IN) R127.1 R128.2
N$133: C47.1 C49.1 D17.6(OUT) IC6.3(+IN) Q91.G R125.1
N$134: Q91.S R125.2
N$135: C48.2 C50.2 D18.4(GND) IC5.3(+IN) Q92.D
N$136: Q92.S R126.2
N$137: C52.2 C54.1 IC5.2(-IN) R129.1 R130.2
N$138: LED18.C R132.2
N$139: LED17.A R131.1
UV+IN: C37.+ C42.2 C58.2 D15.C LED15.A Q87.C Q89.C R115.1 R119.1 ; also sheet 4
UV-IN: C38.- C39.1 C60.1 D16.A LED16.C Q88.C Q90.C R116.2 R122.2 ; also sheet 4
V+: C45.2 C53.1 C55.2 D15.A IC6.7(V+) Q89.E Q91.D R127.2 R131.2 ; also sheet 1,2
V-: C46.1 C54.2 C56.1 D16.C IC5.4(V-) Q90.E Q92.G R126.1 R130.1 R132.1 ; also sheet 1,2
Unconnected: IC5.1(CMP1) IC5.8(CMP2) IC6.1(CMP1) IC6.8(CMP2)

### Notes on the sheet
- Golden Reference Power Supply

## Sheet 4 of 4: 4.Sync Refi
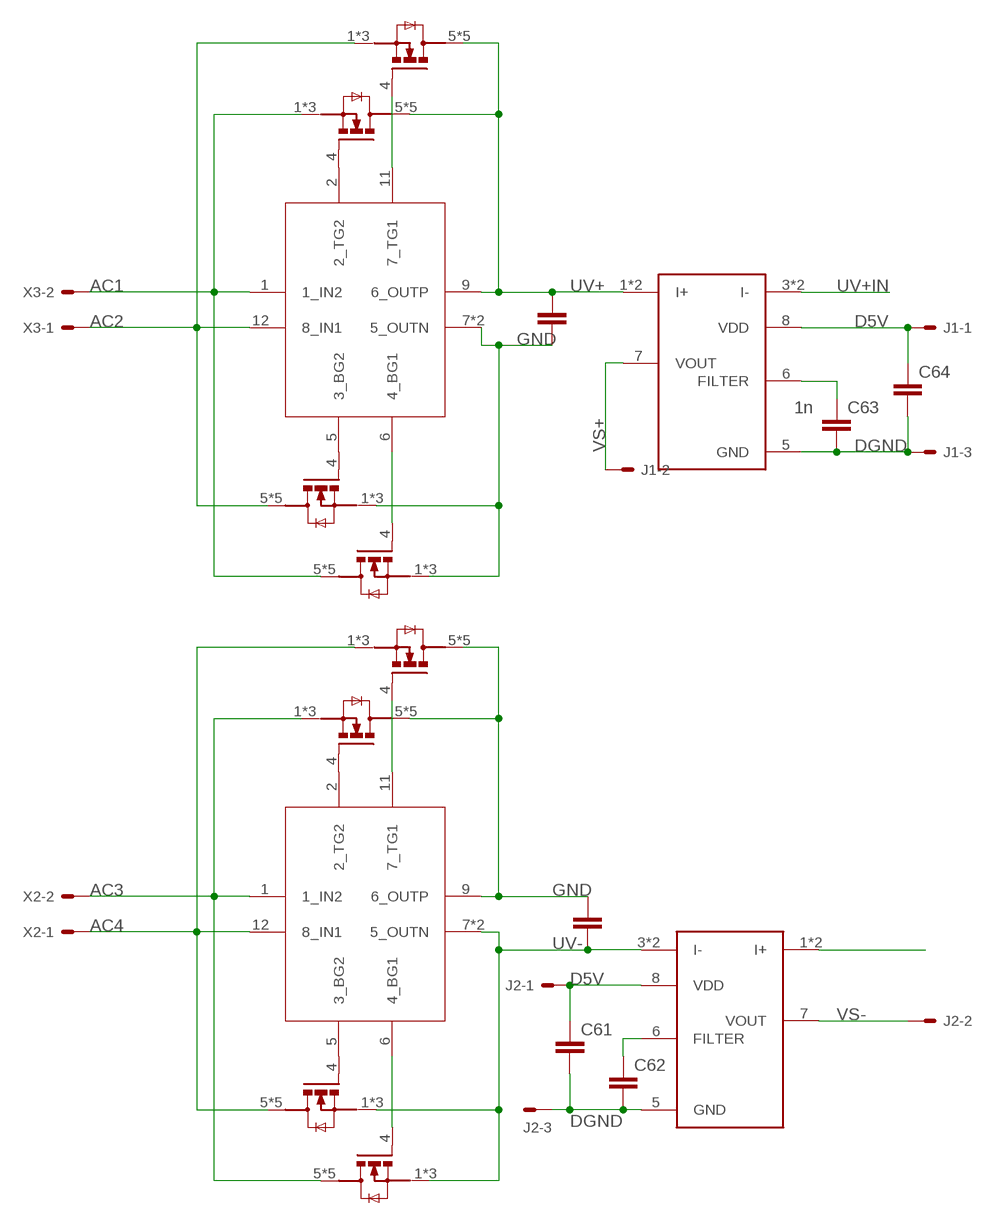
[diagram p3: schematic, sheet 4]

### Parts
C57  47uF  C-EUC1206  [C1206]
C59  47uF  C-EUC1206  [C1206]
C61  C-EUC0805  [C0805]
C62  C-EUC0805  [C0805]
C63  1n  C-EUC0805  [C0805]
C64  C-EUC0805  [C0805]
J1  22-27-2031-03  [6410-03]
J2  22-27-2031-03  [6410-03]
Q97  MOS_SMDTDSON-8  [PG-TDSON-8]
Q98  MOS_SMDTDSON-8  [PG-TDSON-8]
Q99  MOS_SMDTDSON-8  [PG-TDSON-8]
Q100  MOS_SMDTDSON-8  [PG-TDSON-8]
Q105  MOS_SMDTDSON-8  [PG-TDSON-8]
Q106  MOS_SMDTDSON-8  [PG-TDSON-8]
Q107  MOS_SMDTDSON-8  [PG-TDSON-8]
Q108  MOS_SMDTDSON-8  [PG-TDSON-8]
U$1  ACHS-712X  [SO8]
U$2  LT4320MSOP  [LT4320_MSOP]
U$3  ACHS-712X  [SO8]
U$4  LT4320MSOP  [LT4320_MSOP]
X2  KK-156-2  [KK-156-2]
X3  KK-156-2  [KK-156-2]

### Nets
AC1: Q97.1(S) Q97.2(S) Q97.3(S) Q100.5(D) Q100.6(D) Q100.7(D) Q100.8(D) Q100.TH(D) U$2.1(1_IN2) X3.2
AC2: Q98.1(S) Q98.2(S) Q98.3(S) Q99.5(D) Q99.6(D) Q99.7(D) Q99.8(D) Q99.TH(D) U$2.12(8_IN1) X3.1
AC3: Q105.1(S) Q105.2(S) Q105.3(S) Q108.5(D) Q108.6(D) Q108.7(D) Q108.8(D) Q108.TH(D) U$4.1(1_IN2) X2.2
AC4: Q106.1(S) Q106.2(S) Q106.3(S) Q107.5(D) Q107.6(D) Q107.7(D) Q107.8(D) Q107.TH(D) U$4.12(8_IN1) X2.1
D5V: C61.1 C64.1 J1.1 J2.1 U$1.8(VDD) U$3.8(VDD)
DGND: C61.2 C62.2 C63.2 C64.2 J1.3 J2.3 U$1.5(GND) U$3.5(GND)
GND: C57.2 C59.1 Q99.1(S) Q99.2(S) Q99.3(S) Q100.1(S) Q100.2(S) Q100.3(S) Q105.5(D) Q105.6(D) Q105.7(D) Q105.8(D) Q105.TH(D) Q106.5(D) Q106.6(D) Q106.7(D) Q106.8(D) Q106.TH(D) U$2.7(5_OUTN) U$2.EXP(5_OUTN) U$4.9(6_OUTP) ; also sheet 1,2,3
N$91: C62.1 U$3.6(FILTER)
N$143: C63.1 U$1.6(FILTER)
N$157: Q98.4(G) U$2.11(7_TG1)
N$184: Q100.4(G) U$2.6(4_BG1)
N$188: Q97.4(G) U$2.2(2_TG2)
N$189: Q99.4(G) U$2.5(3_BG2)
N$201: Q106.4(G) U$4.11(7_TG1)
N$204: Q108.4(G) U$4.6(4_BG1)
N$208: Q105.4(G) U$4.2(2_TG2)
N$209: Q107.4(G) U$4.5(3_BG2)
UV+: C57.1 Q97.5(D) Q97.6(D) Q97.7(D) Q97.8(D) Q97.TH(D) Q98.5(D) Q98.6(D) Q98.7(D) Q98.8(D) Q98.TH(D) U$1.1(I+) U$1.2(I+) U$2.9(6_OUTP)
UV+IN: U$1.3(I-) U$1.4(I-) ; also sheet 3
UV-: C59.2 Q107.1(S) Q107.2(S) Q107.3(S) Q108.1(S) Q108.2(S) Q108.3(S) U$3.3(I-) U$3.4(I-) U$4.7(5_OUTN) U$4.EXP(5_OUTN)
UV-IN: U$3.1(I+) U$3.2(I+) ; also sheet 3
VS+: J1.2 U$1.7(VOUT)
VS-: J2.2 U$3.7(VOUT)

## Library data of the parts
C1 C3 C4 C9-C16 C23 C24 C33 C34 C39-C64 = Vwvwbg:C-EU: CAPACITOR, European symbol
C5-C8 C25 C26 C35-C38 = Vwvwbg:CPOL-EU: POLARIZED CAPACITOR, European symbol
C17-C22 C27-C32 = Vwvwbg:C-EU: CAPACITOR, European symbol; SPICEPREFIX: C
D1-D12 = Vwvwbg:DIODE-: DIODE; SPICEPREFIX: D
D13-D16 = Vwvwbg:DIODE-: DIODE
D17 D18 = Vwvwbg:LINEAR-TECHNOLOGY_LT1021-V
H1-H8 = Vwvwbg:HOLE
IC1-IC6 = Vwvwbg:LT10*: Low Noise, High Speed, Precision Operational Amplifiers Source: http://www.linear.com/pc/downloadDocument.do?navId=H0,C1,C1154,C1009,C1026,P1212,D2204
J1 J2 = con-molex:22-?-03: CONNECTOR wire to board 2.54 mm (.1 inch) pitch header; MF: MOLEX; OC_FARNELL: unknown; OC_NEWARK: unknown
LED1 LED3-LED8 LED13-LED18 = Vwvwbg:LED: LED OSRAM: - CHIPLED LG R971, LG N971, LY N971, LG Q971, LY Q971, LO R971, LY R971 LH N974, LH R974 LS Q976, LO Q976, LY Q976 LO Q996 - Hyper CHIPLED LW Q18S LB Q993, LB Q99A, LB R99A - SideLED LS A670, LO A670, LY A670, LG A670, LP A670 LB A673, LV A673, LT A673, LW A673 LH A674 LY A675 LS A676, LA A676, LO A676, LY A676, LW A676 LS A679, LY A679, LG A679 - Hyper Micro SIDELED® LS Y876, LA Y876, LO Y876, LY Y876 LT Y87S - SmartLED LW L88C, LW L88S LB L89C, LB L89S, LG L890 LS L89K, LO L89K, LY L89K LS L896, LA L896, LO L896, LY L896 - TOPLED LS T670, LO T670, LY T670, LG T670, LP T670 LSG T670, LSP T670, LSY T670, LOP T670, LYG T670 LG T671, LOG T671, LSG T671 LB T673, LV T673, LT T673, LW T673 LH T674 LS T676, LA T676, LO T676, LY T676, LB T676, LH T676, LSB T676, LW T676 LB T67C, LV T67C, LT T67C, LS T67K, LO T67K, LY T67K, LW E67C LS E67B, LA E67B, LO E67B, LY E67B, LB E67C, LV E67C, LT E67C LW T67C LS T679, LY T679, LG T679 LS T770, LO T770, LY T770, LG T770, LP T770 LB T773, LV T773, LT T773, LW T773 LH T774 LS E675, LA E675, LY E675, LS T675 LS T776, LA T776, LO T776, LY T776, LB T776 LHGB T686 LT T68C, LB T68C - Hyper Mini TOPLED® LB M676 - Mini TOPLED Santana® LG M470 LS M47K, LO M47K, LY M47K Source: http://www.osram.convergy.de LUXEON: - LUMILED® LXK2-PW12-R00, LXK2-PW12-S00, LXK2-PW14-U00, LXK2-PW14-V00 LXK2-PM12-R00, LXK2-PM12-S00, LXK2-PM14-U00 LXK2-PE12-Q00, LXK2-PE12-R00, LXK2-PE12-S00, LXK2-PE14-T00, LXK2-PE14-U00 LXK2-PB12-K00, LXK2-PB12-L00, LXK2-PB12-M00, LXK2-PB14-N00, LXK2-PB14-P00, LXK2-PB14-Q00 LXK2-PR12-L00, LXK2-PR12-M00, LXK2-PR14-Q00, LXK2-PR14-R00 LXK2-PD12-Q00, LXK2-PD12-R00, LXK2-PD12-S00 LXK2-PH12-R00, LXK2-PH12-S00 LXK2-PL12-P00, LXK2-PL12-Q00, LXK2-PL12-R00 Source: www.luxeon.com KINGBRIGHT: KA-3528ASYC Source: www.kingbright.com
LED2 LED9-LED12 = Vwvwbg:LED: LED OSRAM: - CHIPLED LG R971, LG N971, LY N971, LG Q971, LY Q971, LO R971, LY R971 LH N974, LH R974 LS Q976, LO Q976, LY Q976 LO Q996 - Hyper CHIPLED LW Q18S LB Q993, LB Q99A, LB R99A - SideLED LS A670, LO A670, LY A670, LG A670, LP A670 LB A673, LV A673, LT A673, LW A673 LH A674 LY A675 LS A676, LA A676, LO A676, LY A676, LW A676 LS A679, LY A679, LG A679 - Hyper Micro SIDELED® LS Y876, LA Y876, LO Y876, LY Y876 LT Y87S - SmartLED LW L88C, LW L88S LB L89C, LB L89S, LG L890 LS L89K, LO L89K, LY L89K LS L896, LA L896, LO L896, LY L896 - TOPLED LS T670, LO T670, LY T670, LG T670, LP T670 LSG T670, LSP T670, LSY T670, LOP T670, LYG T670 LG T671, LOG T671, LSG T671 LB T673, LV T673, LT T673, LW T673 LH T674 LS T676, LA T676, LO T676, LY T676, LB T676, LH T676, LSB T676, LW T676 LB T67C, LV T67C, LT T67C, LS T67K, LO T67K, LY T67K, LW E67C LS E67B, LA E67B, LO E67B, LY E67B, LB E67C, LV E67C, LT E67C LW T67C LS T679, LY T679, LG T679 LS T770, LO T770, LY T770, LG T770, LP T770 LB T773, LV T773, LT T773, LW T773 LH T774 LS E675, LA E675, LY E675, LS T675 LS T776, LA T776, LO T776, LY T776, LB T776 LHGB T686 LT T68C, LB T68C - Hyper Mini TOPLED® LB M676 - Mini TOPLED Santana® LG M470 LS M47K, LO M47K, LY M47K Source: http://www.osram.convergy.de LUXEON: - LUMILED® LXK2-PW12-R00, LXK2-PW12-S00, LXK2-PW14-U00, LXK2-PW14-V00 LXK2-PM12-R00, LXK2-PM12-S00, LXK2-PM14-U00 LXK2-PE12-Q00, LXK2-PE12-R00, LXK2-PE12-S00, LXK2-PE14-T00, LXK2-PE14-U00 LXK2-PB12-K00, LXK2-PB12-L00, LXK2-PB12-M00, LXK2-PB14-N00, LXK2-PB14-P00, LXK2-PB14-Q00 LXK2-PR12-L00, LXK2-PR12-M00, LXK2-PR14-Q00, LXK2-PR14-R00 LXK2-PD12-Q00, LXK2-PD12-R00, LXK2-PD12-S00 LXK2-PH12-R00, LXK2-PH12-S00 LXK2-PL12-P00, LXK2-PL12-Q00, LXK2-PL12-R00 Source: www.luxeon.com KINGBRIGHT: KA-3528ASYC Source: www.kingbright.com; SPICEPREFIX: D
PAD1-PAD4 = Vwvwbg:PAD
Q1 = Vwvwbg:LSK689
Q2 Q10 Q11 Q14 Q16 Q18 Q19 Q22 Q24 Q80 Q81 Q83 Q85 Q88 Q90 = Vwvwbg:BJT_PNP
Q3 Q9 Q12 Q13 Q15 Q17 Q20 Q21 Q23 Q79 Q82 Q84 Q86 Q87 Q89 = Vwvwbg:BJT_NPN
Q4 = Vwvwbg:LSK489
Q5 Q8 = Vwvwbg:LS3550
Q6 Q7 = Vwvwbg:LS3250
Q25 Q26 Q31-Q33 Q35 Q36 Q39 Q41 Q43 Q47 Q49 Q51-Q53 Q58-Q60 Q62 Q63 Q66 Q68 Q70 Q74 Q76 Q78 = Vwvwbg:BJT_PNP; SPICEPREFIX: Q
Q27-Q30 Q34 Q37 Q38 Q40 Q42 Q44-Q46 Q48 Q50 Q54-Q57 Q61 Q64 Q65 Q67 Q69 Q71-Q73 Q75 Q77 = Vwvwbg:BJT_NPN; SPICEPREFIX: Q
Q91 Q92 = Vwvwbg:DN2540
Q97-Q100 Q105-Q108 = Vwvwbg:MOS_SMD
R1 R74 R106 = rcl_mod:R-TRIMM: Trimm resistor; SPICEMODEL: X; SPICEPREFIX: Z; SPICEPREFIXL: POT
R2-R6 R8-R50 R115-R135 = Vwvwbg:R-EU_: RESISTOR, European symbol
R7 R51-R73 R75-R105 R107-R114 = Vwvwbg:R-EU_: RESISTOR, European symbol; SPICEPREFIX: R
S1 = Vwvwbg:VWV
U$1 U$3 = Vwvwbg:ACHS-712X
U$2 U$4 = Vwvwbg:LT4320
X1 = Vwvwbg:KK-156-3: KK 156 HEADER Source: http://www.molex.com/pdm_docs/sd/026604100_sd.pdf; MF: MOLEX; OC_FARNELL: unknown; OC_NEWARK: unknown
X2 X3 = Vwvwbg:KK-156-2: KK 156 HEADER Source: http://www.molex.com/pdm_docs/sd/026604100_sd.pdf; MF: MOLEX; OC_FARNELL: unknown; OC_NEWARK: unknown